# EAGLE design KM2 (EAGLE 7.6.0)
DOCNO: KAMBOT-KM2; PROJECT_DETAIL: KM2 - stepper driver; PROJECT_NAME: KAMBOT; REVISION: A
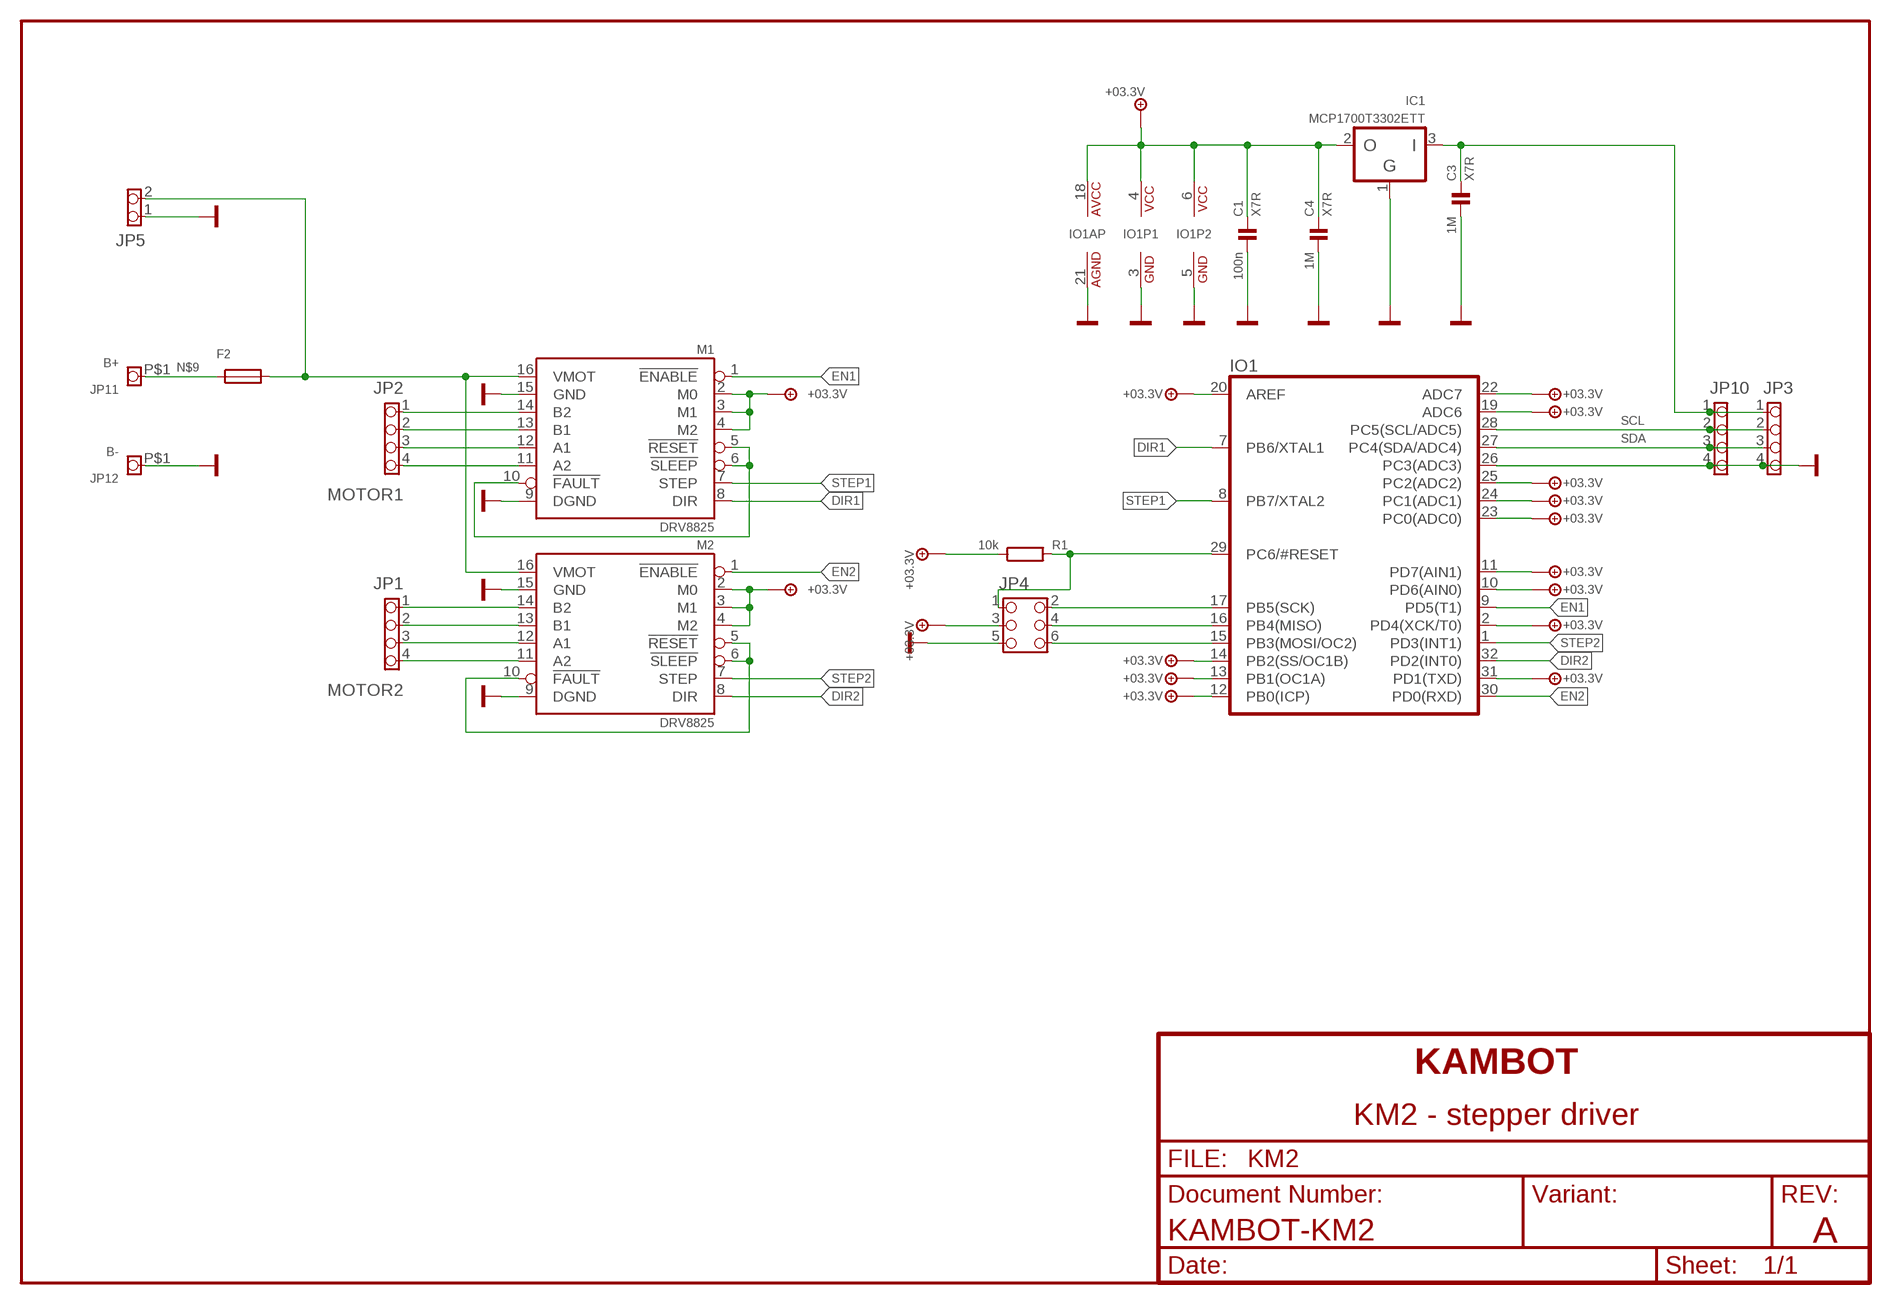
[diagram p0: schematic, sheet 1]

## Parts
C1  100n  C0805  [0805]
C3  1M  C0805  [0805]
C4  1M  C0805  [0805]
F2  F_1812  [1812]
IC1  MCP1700T3302ETT  STAB_IO_SOT23_GOI  [SOT23]
IO1  MEGA8  [TQFP32]
JP1  MOTOR2  PINHD-1X4_254_EDGE  [1X04_254_EDGE]
JP2  MOTOR1  PINHD-1X4_254_EDGE  [1X04_254_EDGE]
JP3  PINHD-1X4_250_MX5267  [1X04_250_MX5267]
JP4  PINHD-2X3_254_FP  [2X03_254_FP]
JP5  PINHD-1X2_250_MX5267  [1X02_250_MX5267]
JP10  PINHD-1X4_250_MX5267  [1X04_250_MX5267]
JP11  B+  PINHD-1X1_254X254PAD  [1X01_254_254_PAD]
JP12  B-  PINHD-1X1_254X254PAD  [1X01_254_254_PAD]
M1  DRV8825  [MODULE_16P]
M2  DRV8825  [MODULE_16P]
R1  10k  R_R0805  [0805]

## Nets
+3.3V: C1.1 C4.1 IC1.2(OUT) IO1.2(PD4(XCK/T0)) IO1.4(VCC) IO1.6(VCC) IO1.10(PD6(AIN0)) IO1.11(PD7(AIN1)) IO1.12(PB0(ICP)) IO1.13(PB1(OC1A)) IO1.14(PB2(SS/OC1B)) IO1.18(VCC) IO1.19(ADC6) IO1.20(AREF) IO1.22(ADC7) IO1.23(PC0(ADC0)) IO1.24(PC1(ADC1)) IO1.25(PC2(ADC2)) IO1.31(PD1(TXD)) JP4.3 M1.2(M0) M1.3(M1) M1.4(M2) M2.2(M0) M2.3(M1) M2.4(M2) R1.1 ; supply symbol labelled +03.3V
DIR1: IO1.7(PB6/XTAL1) M1.8(DIR)
DIR2: IO1.32(PD2(INT0)) M2.8(DIR)
EN1: IO1.9(PD5(T1)) M1.1(!ENABLE)
EN2: IO1.30(PD0(RXD)) M2.1(!ENABLE)
GND: C1.2 C3.2 C4.2 IC1.1(GND) IO1.3(GND) IO1.5(GND) IO1.21(GND) IO1.26(PC3(ADC3)) JP3.4 JP4.5 JP5.1 JP10.4 JP12.P$1 M1.9(DGND) M1.15(GND) M2.9(DGND) M2.15(GND)
N$1: JP1.1 M2.14(B2)
N$2: JP1.2 M2.13(B1)
N$3: JP1.3 M2.12(A1)
N$4: JP1.4 M2.11(A2)
N$5: JP2.1 M1.14(B2)
N$6: JP2.2 M1.13(B1)
N$7: JP2.3 M1.12(A1)
N$8: JP2.4 M1.11(A2)
N$9: F2.1 JP11.P$1
N$13: IO1.17(PB5(SCK)) JP4.2
N$14: IO1.16(PB4(MISO)) JP4.4
N$17: M2.5(!RESET) M2.6(!SLEEP) M2.10(!FAULT)
N$18: M1.5(!RESET) M1.6(!SLEEP) M1.10(!FAULT)
N$22: C3.1 IC1.3(IN) JP3.1 JP10.1
N$23: IO1.15(PB3(MOSI/OC2)) JP4.6
N$24: IO1.29(PC6/#RESET) JP4.1 R1.2
SCL: IO1.28(PC5(SCL/ADC5)) JP3.2 JP10.2
SDA: IO1.27(PC4(SDA/ADC4)) JP3.3 JP10.3
STEP1: IO1.8(PB7/XTAL2) M1.7(STEP)
STEP2: IO1.1(PD3(INT1)) M2.7(STEP)
VBAT+: F2.2 JP5.2 M1.16(VMOT) M2.16(VMOT)

## Library data of the parts
C1 C3 C4 = !discrete:C: Kondenzator; MATERIAL: X7R
F2 = !discrete:F: Pojistka
IC1 = !stab:STAB_IO: IO - Stabilizator MCP1754 - SOT23_GOI - LDO Iq=60uA Io=150mA Vi=16V Vo=1.8V, 2.5V,2.8V,3.0V, 3.3V,4.0V,5.0V MCP1700 - SOT23_GOI - LDO Iq=1.6uA Io=250mA, Vi=6V, Vo=3.3V
IO1 = !ic_avr:MEGA8: IO - Mikrokontroler
JP1-JP3 JP10 = !pinhead:PINHD-1X4: Konektor 4 PIN Typ Rastr Imax Umax Rmax Kontakt 2.54 mm 500 mA 125 V 50 mOhm krimp /90 2.54 mm 500 mA 125 V 50 mOhm krimp _MX5267 2.50 mm 2.5 A 250 V 20 mOhm krimp _MX53048 1.25 mm 800 mA 125 V 20 mOhm krimp _PV-3.81 3.81 mm 8 A 130 V 30 mOhm ?roub
JP4 = !pinhead:PINHD-2X3: Konektor 3 PIN dvourady
JP5 = !pinhead:PINHD-1X2: Konektor Typ Rastr Imax Umax Rmax Kontakt 2.54 mm 500 mA 125 V 50 mOhm krimp /90 2.54 mm 500 mA 125 V 50 mOhm krimp _MX5267 2.50 mm 2.5 A 250 V 20 mOhm krimp _MX53048 1.25 mm 800 mA 125 V 20 mOhm krimp _PV-3.81 3.81 mm 8 A 130 V 30 mOhm ?roub
JP11 JP12 = !pinhead:PINHD-1X1: Konektor Typ Rastr Imax Umax Rmax Kontakt 2.54 mm 500 mA 125 V 50 mOhm krimp /90 2.54 mm 500 mA 125 V 50 mOhm krimp _MX5267 2.50 mm 2.5 A 250 V 20 mOhm krimp _MX53048 1.25 mm 800 mA 125 V 20 mOhm krimp _PV-3.81 3.81 mm 8 A 130 V 30 mOhm sroub WAGO25x 5.08 mm 16 A 250 VAC - pero WAGO25x 7.62 mm 16 A 380 VAC - pero WAGO25x 10.16 mm 16 A 500 VAC - pero
M1 M2 = pololu:DRV8825
R1 = !discrete:R_: Rezistor

## Board
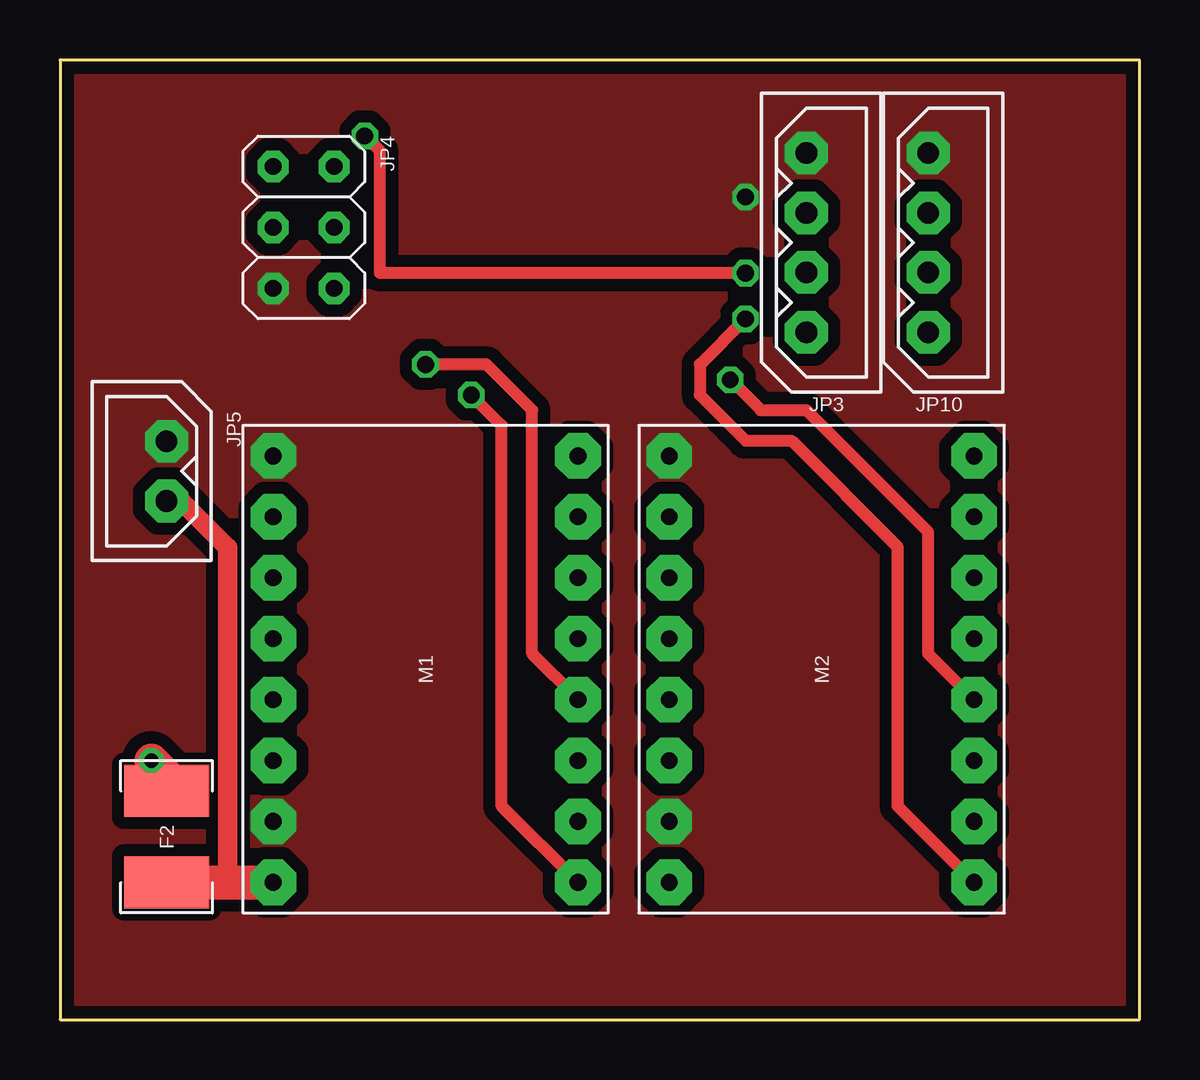
[diagram p1: board, top side]
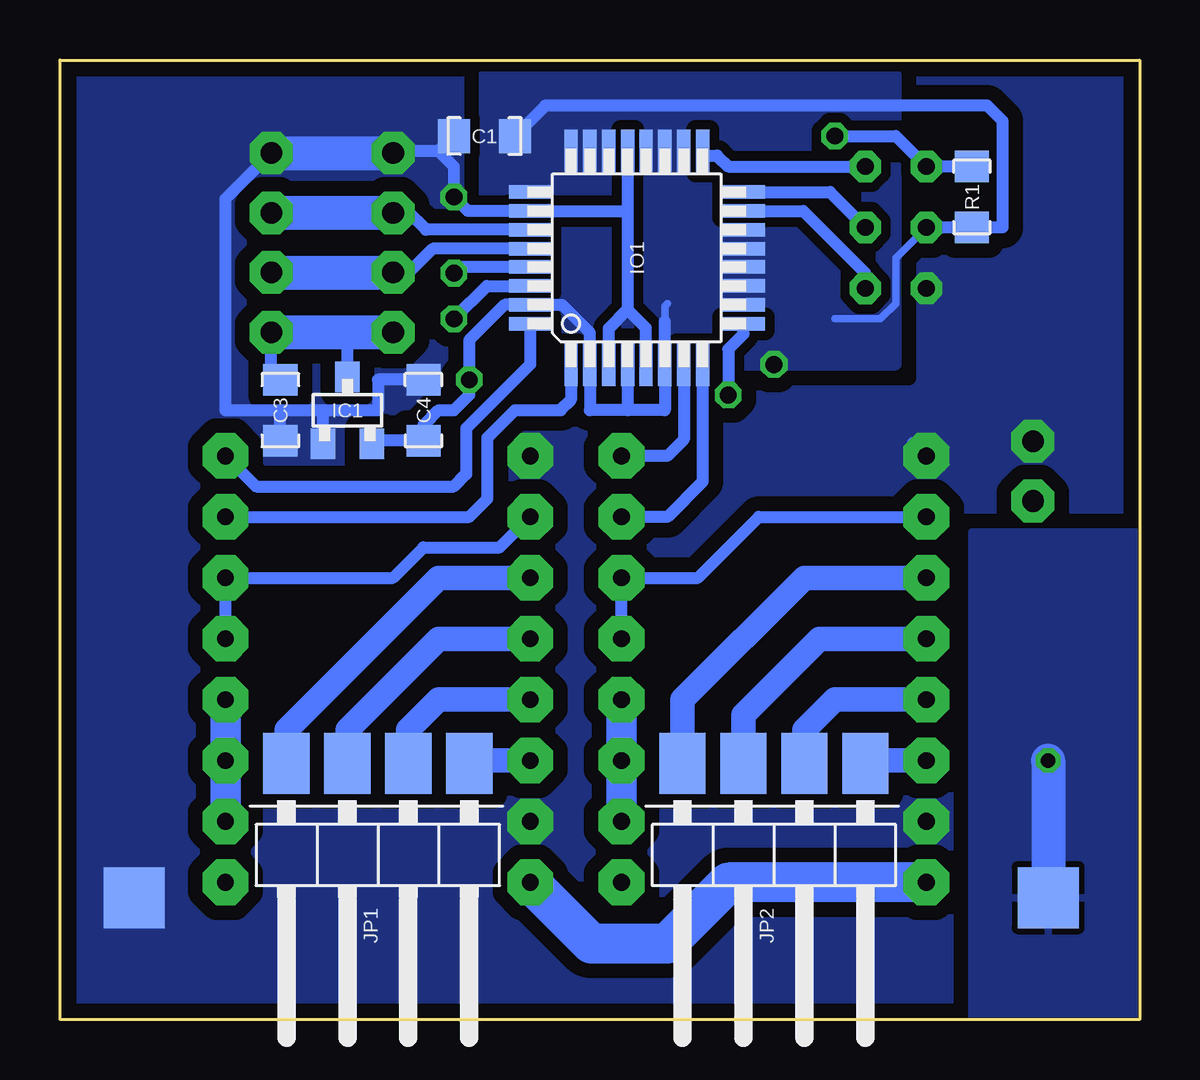
[diagram p2: board, bottom side, seen from below]

Size 45 x 40 mm. Coordinates in mm from the lower left corner, seen from the top.
Outline: 0,0 45,0 45,40 0,40 0,0
Copper layers (1*16): Top 0.035mm / dielectric 1.5mm / Bottom 0.035mm
Design rules "default *": minimum track width 10mil, minimum drill 24mil, track to track 8mil, track to pad 8mil, pad to pad 8mil, via to via 8mil, smd to smd 8mil, copper to edge 1mil, drill to drill 1mil, minimum pad ring 10mil, minimum via ring 8mil, stop-mask expansion 4mil, vias tented up to drill 0mil, thermal gap 10mil

### Footprints (pad centres in the part's own frame; a part is rotated, then mirrored left to right if it is on the bottom)
0805 = smd 1.321 x 1.422: 1 -1.27,0; 2 1.27,0
1812 = smd 2.159 x 3.556: 1 -1.905,0; 2 1.905,0
SOT23 = smd 1.016 x 1.27: 1 -1.016,-1.397; 2 1.016,-1.397; 3 0,1.397
TQFP32 = smd 1.778 x 0.559: 1 -4.445,2.743; 2 -4.445,1.956; 3 -4.445,1.168; 4 -4.445,0.381; 5 -4.445,-0.381; 6 -4.445,-1.168; 7 -4.445,-1.956; 8 -4.445,-2.743; 17 4.445,-2.743; 18 4.445,-1.956; 19 4.445,-1.168; 20 4.445,-0.381; 21 4.445,0.381; 22 4.445,1.168; 23 4.445,1.956; 24 4.445,2.743 | smd 0.559 x 1.778: 9 -2.743,-4.445; 10 -1.956,-4.445; 11 -1.168,-4.445; 12 -0.381,-4.445; 13 0.381,-4.445; 14 1.168,-4.445; 15 1.956,-4.445; 16 2.743,-4.445; 25 2.743,4.445; 26 1.956,4.445; 27 1.168,4.445; 28 0.381,4.445; 29 -0.381,4.445; 30 -1.168,4.445; 31 -1.956,4.445; 32 -2.743,4.445
1X04_254_EDGE = smd 1.93 x 2.54: 1 -2.54,-1.778; 2 0,-1.778; 3 2.54,-1.778; 4 5.08,-1.778
1X04_250_MX5267 = drill 0.9 pad 1.778 octagon: 1 -3.734,0; 2 -1.245,0; 3 1.245,0; 4 3.734,0
2X03_254_FP = drill 0.7 pad 1.3 octagon: 1 -2.54,-1.27; 2 -2.54,1.27; 3 0,-1.27; 4 0,1.27; 5 2.54,-1.27; 6 2.54,1.27
1X02_250_MX5267 = drill 0.9 pad 1.778 octagon: 1 -1.245,0; 2 1.245,0
1X01_254_254_PAD = smd 2.54 x 2.54: P$1 0,0
MODULE_16P = drill 0.7 pad 1.905 octagon: 1 -6.35,8.89; 2 -6.35,6.35; 3 -6.35,3.81; 4 -6.35,1.27; 5 -6.35,-1.27; 6 -6.35,-3.81; 7 -6.35,-6.35; 8 -6.35,-8.89; 9 6.35,-8.89; 10 6.35,-6.35; 11 6.35,-3.81; 12 6.35,-1.27; 13 6.35,1.27; 14 6.35,3.81; 15 6.35,6.35; 16 6.35,8.89

### Placement (x,y rotation side)
C1  27.3,36.83 180 bottom
C3  35.81,25.4 270 bottom
C4  29.84,25.4 90 bottom
F2  4.45,7.62 270 top
IC1  33.02,25.4 0 bottom
IO1  20.95,31.75 90 bottom
JP1  30.48,8.89 180 bottom
JP2  13.97,8.89 180 bottom
JP3  31.11,32.38 90 top
JP4  10.16,33.02 270 top
JP5  4.45,22.86 270 top
JP10  36.2,32.38 90 top
JP11  3.81,5.08 180 bottom
JP12  41.91,5.08 180 bottom
M1  15.24,14.61 180 top
M2  31.75,14.61 180 top
R1  6.99,34.29 90 bottom
U$2  [DIN_DOCFIELD_SCALE2]  11.43,-73.66 0 top  (outside the outline)
U$3  [DIN_A4_SCALE2]  -27.94,-73.66 0 top  (outside the outline)

### Tracks (layer width: path | path; a pad name or v marks a point on that pad's centre or on a via)
+3.3V  (via drill 0.7)
  Top 0.508: M2.4 36.2,15.24 36.2,20.32 31.11,25.4 29.21,25.4 v27.94,26.67 | M1.4 19.68,15.24 19.68,25.4 17.78,27.3 v15.24,27.3
  Bottom 0.305: 19.79,25.4 19.79,29.74 19.68,29.84 | JP4.3 10.16,31.75 10.16,29.84 10.79,29.21 12.7,29.21
  Bottom 0.508: 31.75,24.13 C4.1 29.84,24.77 29.21,25.4 28.57,25.4 27.94,26.04 v27.94,26.67 27.94,28.32 26.47,29.79 IO1.31 24.08,29.79 22.91,28.63 IO1.2 22.91,25.4 21.34,25.4 | 31.75,24.13 31.88,24.13 IC1.2 31.88,24 31.75,24.13 | C1.1 24.77,38.1 6.35,38.1 5.71,37.47 5.71,33.02 R1.1 JP4.3 | 19.79,29.11 IO1.6 19.79,25.4 21.34,25.4 | IO1.4 21.34,25.4
  Bottom 1.27: M2.2 M2.3 M2.4 | M1.4 M1.3 M1.2
  pour Bottom (isolate 0.406, no thermals): 10.16,39.37 27.3,39.37 27.3,34.29 24.13,34.29 24.13,27.3 10.16,27.3
DIR1
  Bottom 0.508: IO1.7 19,24.18 19.68,23.5 M1.8
DIR2
  Bottom 0.508: M2.8 36.83,22.23 28.57,22.23 28.07,22.73 28.07,24.64 25.4,27.3 IO1.32
EN1  (via drill 0.7)
  Top 0.508: M1.1 18.41,8.89 18.41,24.77 v17.14,26.04
  Bottom 0.508: v17.14,26.04 17.14,27.94 16.51,28.57 IO1.9
EN2  (via drill 0.7)
  Top 0.508: M2.1 34.92,8.89 34.92,19.68 30.48,24.13 28.57,24.13 26.67,26.04 26.67,27.3 v28.57,29.21
  Bottom 0.508: v28.57,29.21 27.2,30.58 IO1.30
GND  (via drill 0.7)
  Bottom 0.508: IO1.5 20.57,28.83 21.34,29.59 | IO1.21 21.34,33.66 | 21.34,33.66 21.34,29.59 | 21.34,33.66 21.39,33.71 IO1.26 27.99,33.71 v28.57,34.29 28.57,35.56 29.21,36.2 | IO1.3 22.12,28.8 21.34,29.59 | C3.2 35.81,25.4 | 35.81,25.4 34.04,25.4 | 34.04,25.4 31.75,25.4 31.75,26.67 C4.2 | IC1.1 34.04,25.4 | JP10.4 38.1,34.21 38.1,25.4 35.81,25.4 | 9.43,24.04 M1.9 | 29.21,36.2 31.04,36.2 JP3.4 | C1.2 29.21,36.2
  Bottom 1.422: JP10.4 JP3.4
  pour Top (isolate 0.508, rank 6, no thermals): -0.64,-0.64 45.47,-0.64 45.47,40.37 -0.64,40.37
  pour Top (no thermals): 14.62,39.27 14.62,34.63 27.62,34.63 27.62,39.27
  pour Bottom (isolate 0.61, rank 6, no thermals): 45.72,-0.64 45.72,40.64 -0.64,40.64 -0.64,-0.64
N$1
  Bottom 1.016: M2.14 27.81,10.79 JP1.1
N$2
  Bottom 1.016: M2.13 29.21,13.34 30.48,12.06 JP1.2
N$3
  Bottom 1.016: M2.12 29.21,15.88 33.02,12.06 JP1.3
N$4
  Bottom 1.016: M2.11 29.21,18.41 35.56,12.06 JP1.4
N$5
  Bottom 1.016: M1.14 11.43,10.79 JP2.1
N$6
  Bottom 1.016: M1.13 12.7,13.34 13.97,12.06 JP2.2
N$7
  Bottom 1.016: M1.12 13.34,15.88 16.51,12.7 JP2.3
N$8
  Bottom 1.016: M1.11 13.97,18.41 19.05,13.34 JP2.4
N$9  (via drill 0.6)
  Top 1.422: F2.1 4.45,10.16 v3.81,10.79
  Bottom 1.422: v3.81,10.79 JP11.P$1
  pour Bottom: 0,0 6.99,0 6.99,20.32 0,20.32
N$13
  Bottom 0.508: IO1.17 18.04,36.02 17.61,36.02 17.14,35.56 JP4.2
N$14
  Bottom 0.508: IO1.16 12.9,34.49 JP4.4
N$17
  Bottom 0.508: M2.10 26.67,19.68 29.84,19.68 31.11,18.41 M2.6 M2.5
N$18
  Bottom 0.508: M1.10 15.88,20.95 18.41,18.41 M1.6 M1.5
N$22
  Bottom 0.508: C3.1 36.2,26.67 JP10.1 | IC1.3 33.02,28.65
  Bottom 1.422: JP10.1 33.02,28.65 JP3.1
N$23
  Bottom 0.508: IO1.15 14.02,33.71 11.43,31.11 JP4.6
N$24  (via drill 0.7)
  Top 0.508: v28.57,31.11 13.34,31.11 13.34,36.2 v12.7,36.83
  Bottom 0.508: IO1.29 28.32,31.37 v28.57,31.11 | R1.2 JP4.1 10.16,36.83 v12.7,36.83
SCL
  Bottom 0.508: IO1.28 29.46,32.13 30.48,31.11 31.09,31.11 JP3.2
  Bottom 1.422: JP10.2 JP3.2
SDA
  Bottom 0.508: IO1.27 29.74,32.92 30.48,33.66 31.09,33.66 JP3.3
  Bottom 1.422: JP10.3 JP3.3
STEP1
  Bottom 0.508: IO1.8 18.21,22.43 19.68,20.95 M1.7
STEP2
  Bottom 0.508: M2.7 27.94,20.95 27.18,21.72 27.18,24.26 26.04,25.4 24.13,25.4 23.7,25.83 IO1.1
VBAT+
  Top 0.813: JP5.2 5.05,21.61 6.99,19.68 6.99,5.71
  Top 1.422: F2.2 6.99,5.71 M1.16
  Bottom 1.676: M1.16 17.14,5.71 19.68,3.17 22.86,3.17 M2.16

### Text on the board
tRestrict: KM2-A